# EasyEDA schematic SCH_7segment.json
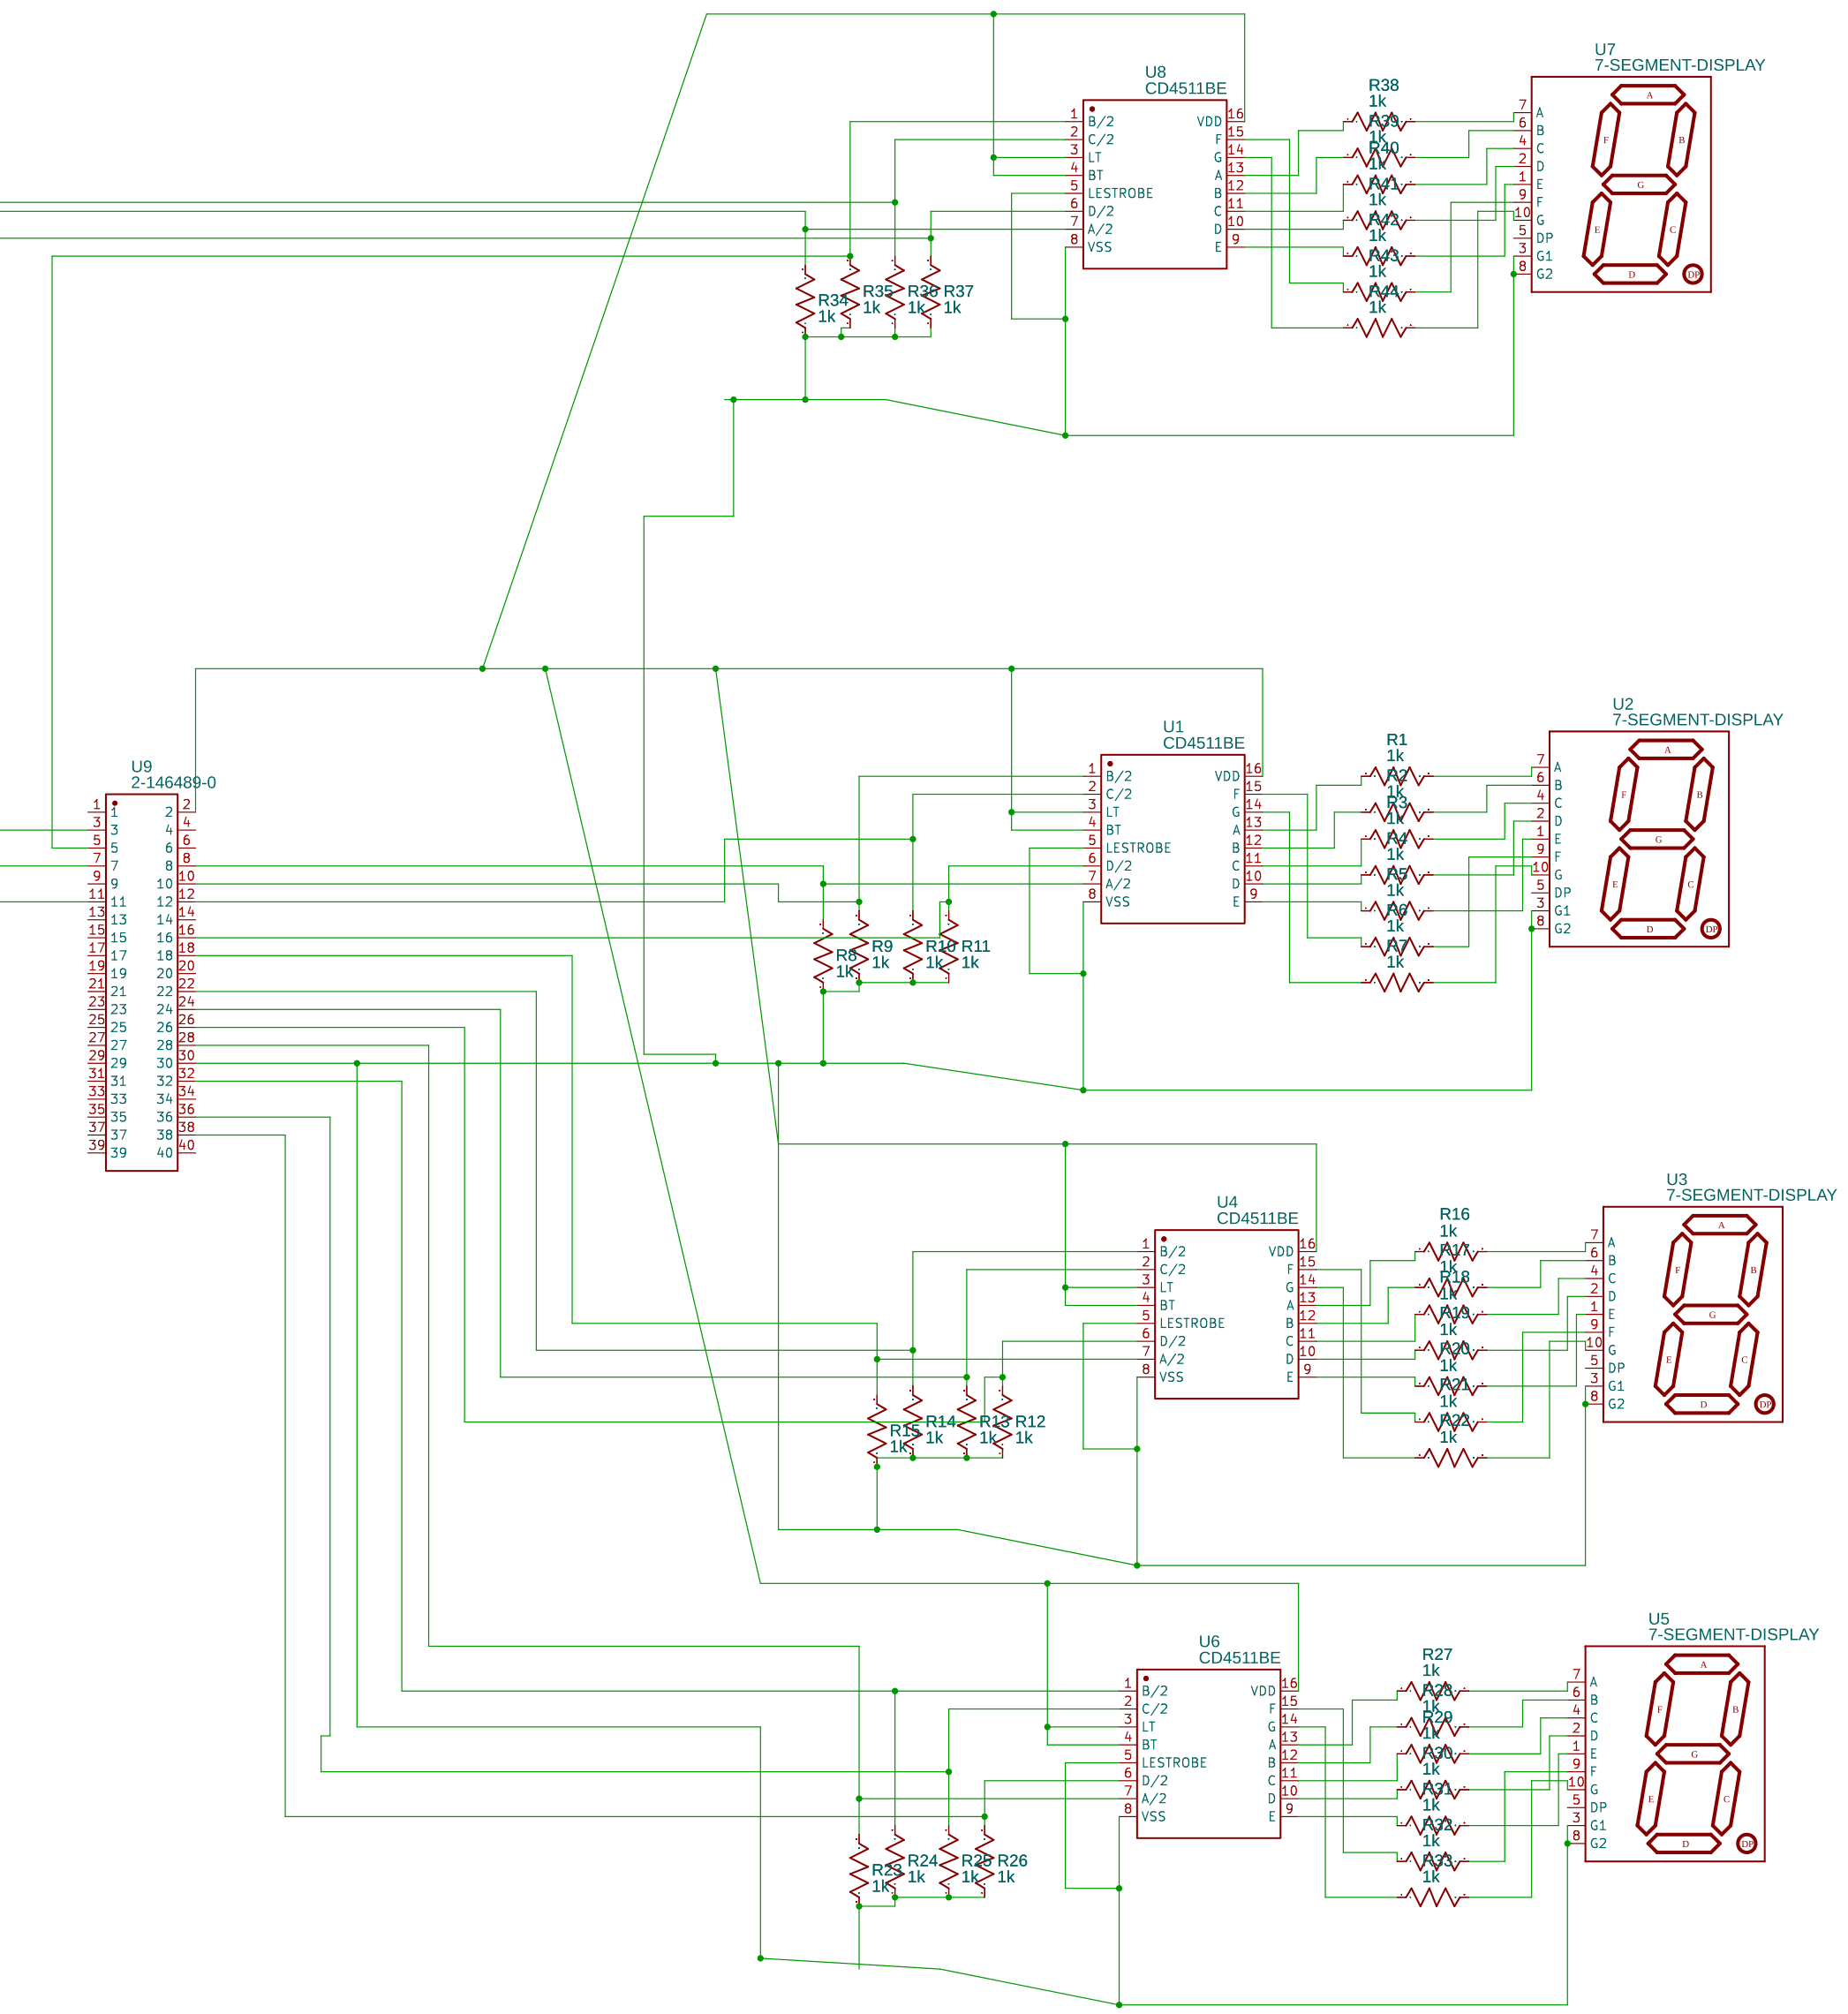
[diagram p0: schematic sheet]

## Parts
R1  1k  [R_AXIAL-0.4]
R2  1k  [R_AXIAL-0.4]
R3  1k  [R_AXIAL-0.4]
R4  1k  [R_AXIAL-0.4]
R5  1k  [R_AXIAL-0.4]
R6  1k  [R_AXIAL-0.4]
R7  1k  [R_AXIAL-0.4]
R8  1k  [R_AXIAL-0.4]
R9  1k  [R_AXIAL-0.4]
R10  1k  [R_AXIAL-0.4]
R11  1k  [R_AXIAL-0.4]
R12  1k  [R_AXIAL-0.4]
R13  1k  [R_AXIAL-0.4]
R14  1k  [R_AXIAL-0.4]
R15  1k  [R_AXIAL-0.4]
R16  1k  [R_AXIAL-0.4]
R17  1k  [R_AXIAL-0.4]
R18  1k  [R_AXIAL-0.4]
R19  1k  [R_AXIAL-0.4]
R20  1k  [R_AXIAL-0.4]
R21  1k  [R_AXIAL-0.4]
R22  1k  [R_AXIAL-0.4]
R23  1k  [R_AXIAL-0.4]
R24  1k  [R_AXIAL-0.4]
R25  1k  [R_AXIAL-0.4]
R26  1k  [R_AXIAL-0.4]
R27  1k  [R_AXIAL-0.4]
R28  1k  [R_AXIAL-0.4]
R29  1k  [R_AXIAL-0.4]
R30  1k  [R_AXIAL-0.4]
R31  1k  [R_AXIAL-0.4]
R32  1k  [R_AXIAL-0.4]
R33  1k  [R_AXIAL-0.4]
R34  1k  [R_AXIAL-0.4]
R35  1k  [R_AXIAL-0.4]
R36  1k  [R_AXIAL-0.4]
R37  1k  [R_AXIAL-0.4]
R38  1k  [R_AXIAL-0.4]
R39  1k  [R_AXIAL-0.4]
R40  1k  [R_AXIAL-0.4]
R41  1k  [R_AXIAL-0.4]
R42  1k  [R_AXIAL-0.4]
R43  1k  [R_AXIAL-0.4]
R44  1k  [R_AXIAL-0.4]
U1  CD4511BE  [DIP-16_L19.8-W6.5-P2.54-LS7.6-BL]
U2  7-SEGMENT-DISPLAY  [7-SEGMENT-DISPLAY]
U3  7-SEGMENT-DISPLAY  [7-SEGMENT-DISPLAY]
U4  CD4511BE  [DIP-16_L19.8-W6.5-P2.54-LS7.6-BL]
U5  7-SEGMENT-DISPLAY  [7-SEGMENT-DISPLAY]
U6  CD4511BE  [DIP-16_L19.8-W6.5-P2.54-LS7.6-BL]
U7  7-SEGMENT-DISPLAY  [7-SEGMENT-DISPLAY]
U8  CD4511BE  [DIP-16_L19.8-W6.5-P2.54-LS7.6-BL]
U9  2-146489-0  [HDR-TH_40P-P2.54-V-M-R2-C20-S2.54-2]

## Library data of the parts
R1-R44 = R_AXIAL-0.4_US: Contributor: LCEDA_Lib
U1 U4 U6 U8 = CD4511BE: Supplier: LCSC; Manufacturer: TI(德州仪器); Supplier Part: C5327; JLCPCB Part Class: Extended Part
U2 U3 U5 U7 = 7-SEGMENT-DISPLAY: Contributor: SparkFun
U9 = 2-146489-0: Supplier: LCSC; Supplier Part: C3334839; Manufacturer: TE Connectivity(美国泰科); Contributor: lcsc

## Nets
Net-(R1-1): R1.1 U1.13(A)
Net-(R1-2): R1.2 U2.7(A)
Net-(R2-1): R2.1 U1.12(B)
Net-(R2-2): R2.2 U2.6(B)
Net-(R3-1): R3.1 U1.11(C)
Net-(R3-2): R3.2 U2.4(C)
Net-(R4-1): R4.1 U1.10(D)
Net-(R4-2): R4.2 U2.2(D)
Net-(R5-1): R5.1 U1.9(E)
Net-(R5-2): R5.2 U2.1(E)
Net-(R6-1): R6.1 U1.15(F)
Net-(R6-2): R6.2 U2.9(F)
Net-(R7-1): R7.1 U1.14(G)
Net-(R7-2): R7.2 U2.10(G)
Net-(R8-1): R8.1 R9.1 R10.1 R11.1 R12.1 R13.1 R14.1 R15.1 R34.1 R35.1 R36.1 R37.1 U1.5(LESTROBE) U1.8(VSS) U2.3(G1) U2.8(G2) U3.3(G1) U3.8(G2) U4.5(LESTROBE) U4.8(VSS) U5.3(G1) U5.8(G2) U6.5(LESTROBE) U6.8(VSS) U7.3(G1) U7.8(G2) U8.5(LESTROBE) U8.8(VSS) U9.30
Net-(R8-2): R8.2 U1.7(A/2) U9.8
Net-(R9-2): R9.2 U1.1(B/2) U9.10
Net-(R10-2): R10.2 U1.2(C/2) U9.12
Net-(R11-2): R11.2 U1.6(D/2) U9.16
Net-(R12-2): R12.2 U4.6(D/2) U9.26
Net-(R13-2): R13.2 U4.2(C/2) U9.24
Net-(R14-2): R14.2 U4.1(B/2) U9.22
Net-(R15-2): R15.2 U4.7(A/2) U9.18
Net-(R16-1): R16.1 U4.13(A)
Net-(R16-2): R16.2 U3.7(A)
Net-(R17-1): R17.1 U4.12(B)
Net-(R17-2): R17.2 U3.6(B)
Net-(R18-1): R18.1 U4.11(C)
Net-(R18-2): R18.2 U3.4(C)
Net-(R19-1): R19.1 U4.10(D)
Net-(R19-2): R19.2 U3.2(D)
Net-(R20-1): R20.1 U4.9(E)
Net-(R20-2): R20.2 U3.1(E)
Net-(R21-1): R21.1 U4.15(F)
Net-(R21-2): R21.2 U3.9(F)
Net-(R22-1): R22.1 U4.14(G)
Net-(R22-2): R22.2 U3.10(G)
Net-(R23-1): R23.1 R24.1 R25.1 R26.1
Net-(R23-2): R23.2 U6.7(A/2) U9.28
Net-(R24-2): R24.2 U6.1(B/2) U9.32
Net-(R25-2): R25.2 U6.2(C/2) U9.36
Net-(R26-2): R26.2 U6.6(D/2) U9.38
Net-(R27-1): R27.1 U6.13(A)
Net-(R27-2): R27.2 U5.7(A)
Net-(R28-1): R28.1 U6.12(B)
Net-(R28-2): R28.2 U5.6(B)
Net-(R29-1): R29.1 U6.11(C)
Net-(R29-2): R29.2 U5.4(C)
Net-(R30-1): R30.1 U6.10(D)
Net-(R30-2): R30.2 U5.2(D)
Net-(R31-1): R31.1 U6.9(E)
Net-(R31-2): R31.2 U5.1(E)
Net-(R32-1): R32.1 U6.15(F)
Net-(R32-2): R32.2 U5.9(F)
Net-(R33-1): R33.1 U6.14(G)
Net-(R33-2): R33.2 U5.10(G)
Net-(R34-2): R34.2 U8.7(A/2) U9.3
Net-(R35-2): R35.2 U8.1(B/2) U9.5
Net-(R36-2): R36.2 U8.2(C/2) U9.7
Net-(R37-2): R37.2 U8.6(D/2) U9.11
Net-(R38-1): R38.1 U8.13(A)
Net-(R38-2): R38.2 U7.7(A)
Net-(R39-1): R39.1 U8.12(B)
Net-(R39-2): R39.2 U7.6(B)
Net-(R40-1): R40.1 U8.11(C)
Net-(R40-2): R40.2 U7.4(C)
Net-(R41-1): R41.1 U8.10(D)
Net-(R41-2): R41.2 U7.2(D)
Net-(R42-1): R42.1 U8.9(E)
Net-(R42-2): R42.2 U7.1(E)
Net-(R43-1): R43.1 U8.15(F)
Net-(R43-2): R43.2 U7.9(F)
Net-(R44-1): R44.1 U8.14(G)
Net-(R44-2): R44.2 U7.10(G)
Net-(U1-3): U1.3(LT) U1.4(BT) U1.16(VDD) U4.3(LT) U4.4(BT) U4.16(VDD) U6.3(LT) U6.4(BT) U6.16(VDD) U8.3(LT) U8.4(BT) U8.16(VDD) U9.2

Not connected (* = marked no-connect by the designer): U2 5(DP); U3 5(DP); U5 5(DP); U7 5(DP); U9 1 4 6 9 13 14 15 17 19 20 21 23 25 27 29 31 33 34 35 37 39 40
